# Altium schematic sheet PERIPHERALS.SchDoc: CONNECTOR A
size A2; DrawnBy: UKAYACIK; Engineer: UKAYACIK; DocumentNumber: 12; Revision: B; SheetNumber: 14; SheetTotal: 21
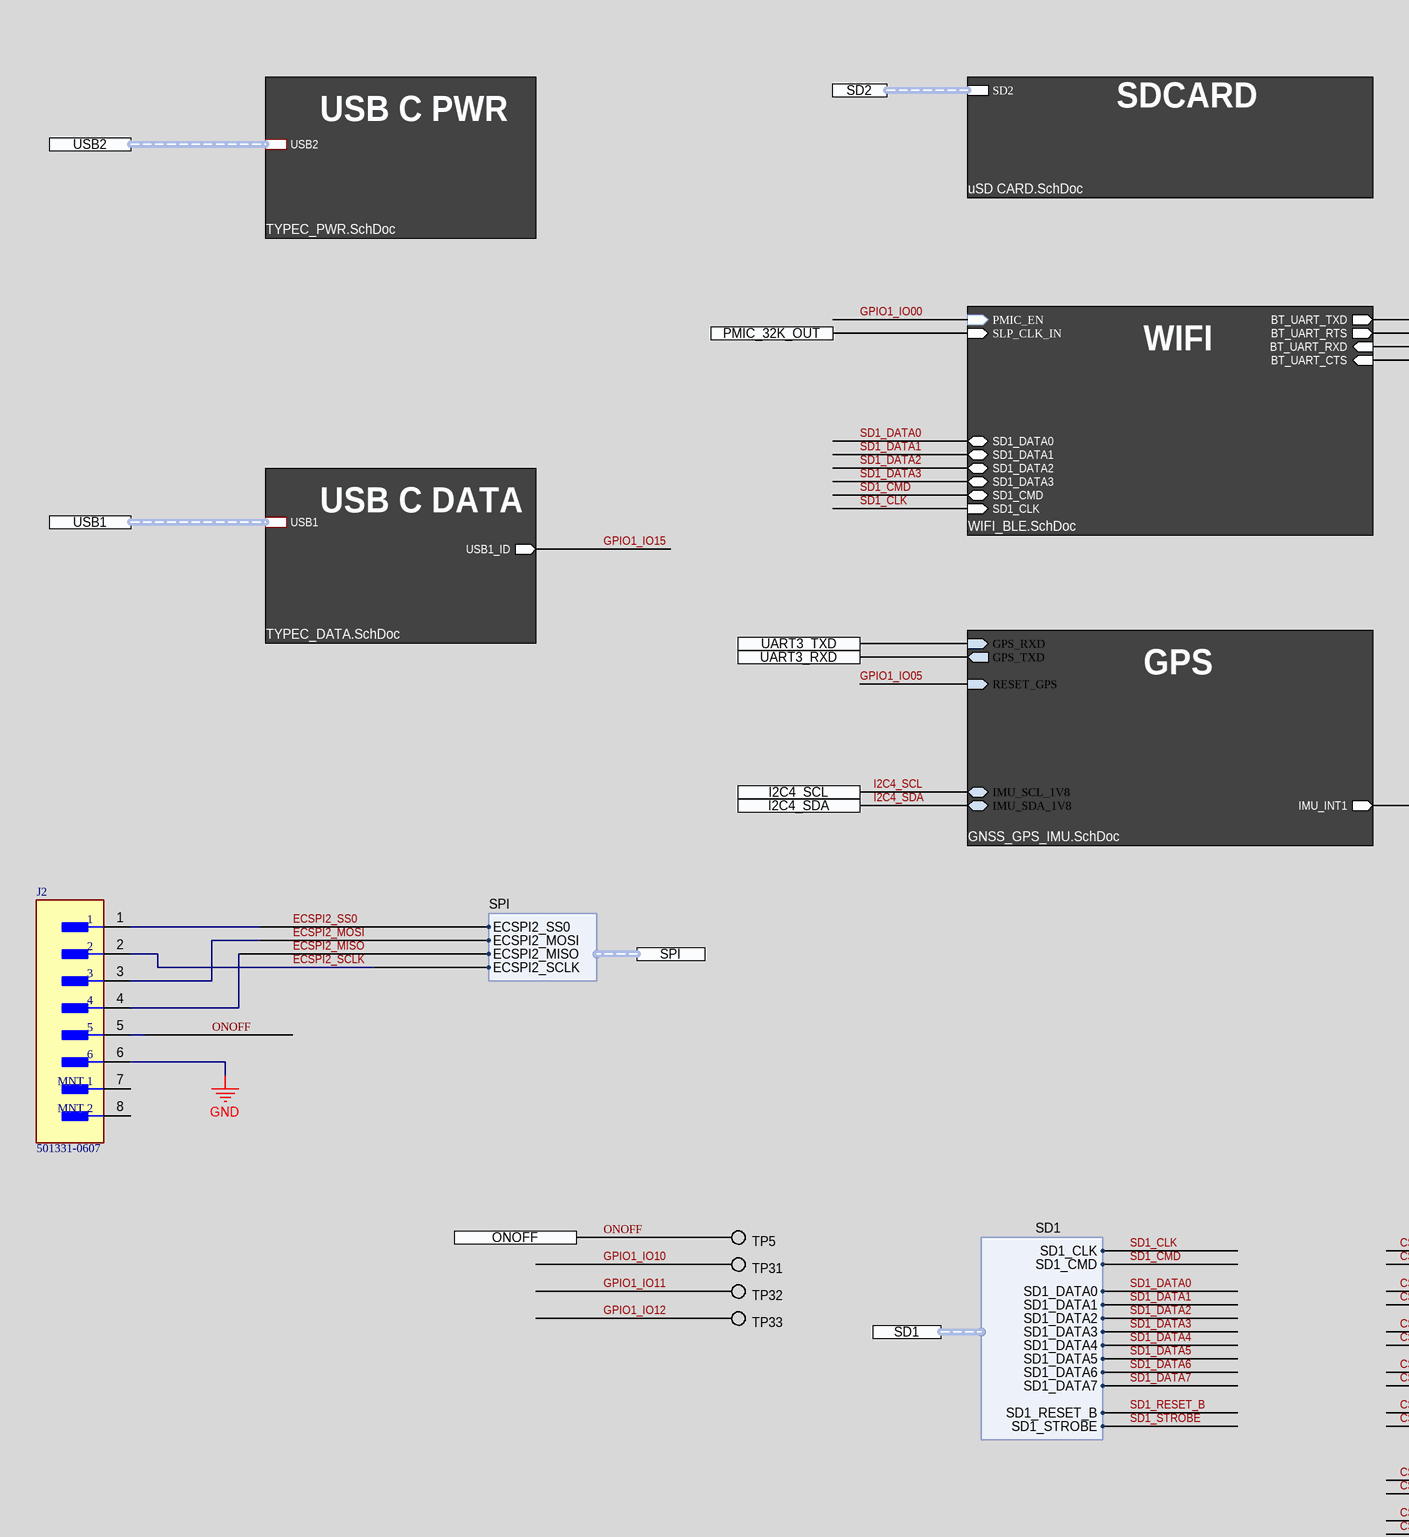
[diagram p0: PERIPHERALS.SchDoc, left]
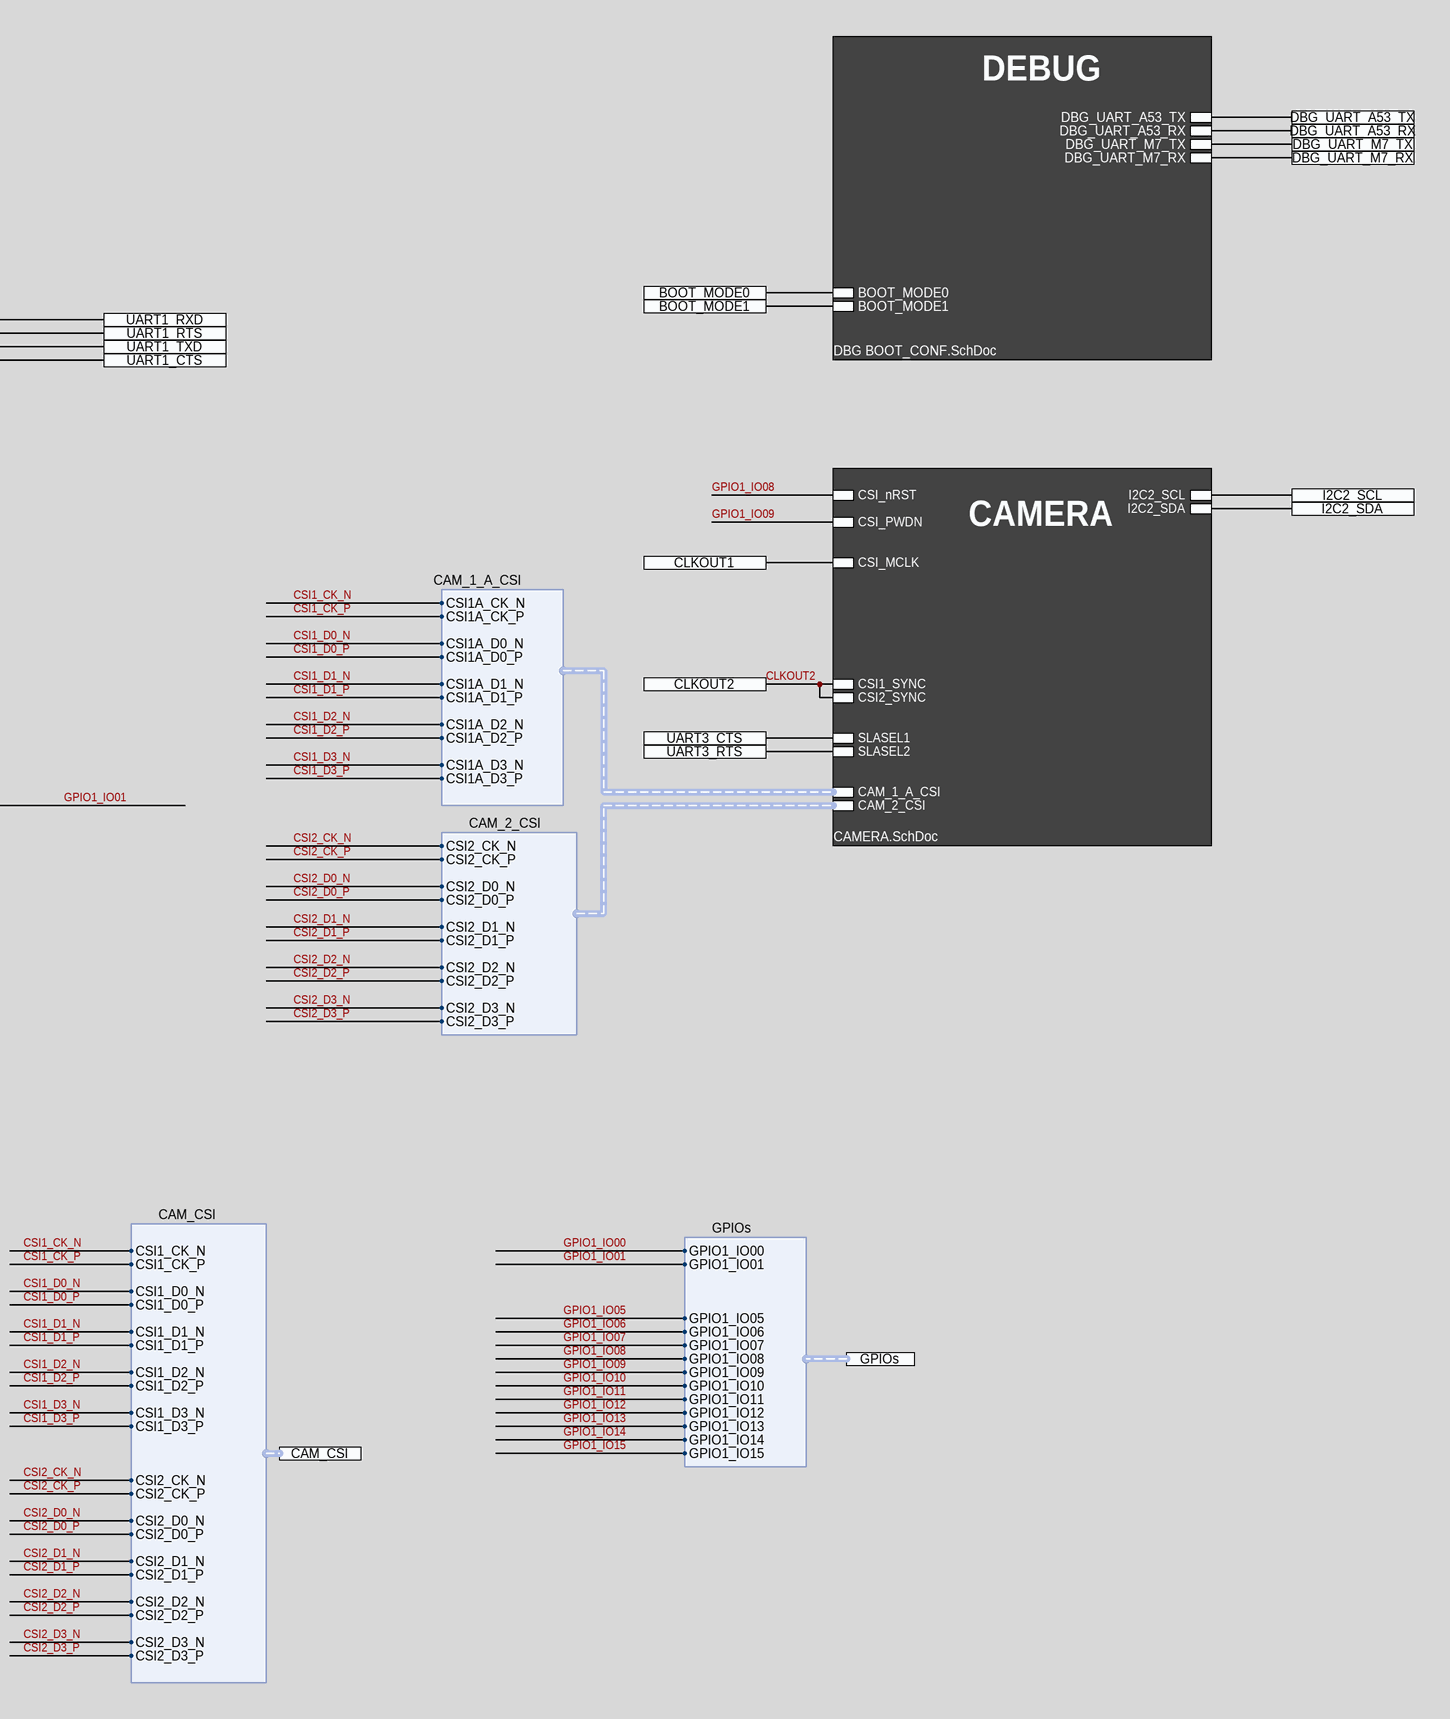
[diagram p1: PERIPHERALS.SchDoc, right]

## Parts
J2  501331-0607  [FP-501331-0607-MFG]
TP5  NO COMPONENT  [TP_PAD_0.5MM_SMD_ROUND]  (value not drawn)  (no BOM)
TP31  NO COMPONENT  [TP_PAD_0.5MM_SMD_ROUND]  (value not drawn)  (no BOM)
TP32  NO COMPONENT  [TP_PAD_0.5MM_SMD_ROUND]  (value not drawn)  (no BOM)
TP33  NO COMPONENT  [TP_PAD_0.5MM_SMD_ROUND]  (value not drawn)  (no BOM)

## Sub-sheets
Designator = TYPEC_PWR.SchDoc: USB2 (harness USB1)
Designator = TYPEC_DATA.SchDoc: USB1 (harness USB1), USB1_ID (out)
U_CAMERA = CAMERA.SchDoc: CSI_PWDN, CSI1_SYNC, CSI_MCLK, CSI_nRST, I2C2_SDA, I2C2_SCL, SLASEL1, CSI2_SYNC, SLASEL2, CAM_2_CSI (harness CAM_2_CSI), CAM_1_A_CSI (harness CAM_1_A_CSI)
U_DBG BOOT_CONF = DBG BOOT_CONF.SchDoc: DBG_UART_A53_TX, DBG_UART_A53_RX, DBG_UART_M7_RX, DBG_UART_M7_TX, BOOT_MODE0, BOOT_MODE1
U_GNSS_GPS_IMU = GNSS_GPS_IMU.SchDoc: IMU_SCL_1V8 (bidir), IMU_SDA_1V8 (bidir), IMU_INT1 (out), GPS_TXD (out), GPS_RXD (in), RESET_GPS (in)
U_uSD CARD = uSD CARD.SchDoc: SD2 (harness SD2)
U_WIFI_BLE = WIFI_BLE.SchDoc: PMIC_EN (in), SLP_CLK_IN (in), SD1_DATA0 (bidir), SD1_DATA1 (bidir), SD1_DATA2 (bidir), SD1_DATA3 (bidir), SD1_CMD (bidir), SD1_CLK (in), BT_UART_CTS (in), BT_UART_RXD (in), BT_UART_TXD (out), BT_UART_RTS (out)

## Ports
BOOT_MODE0, BOOT_MODE1, CAM_CSI (harness CAM_CSI), CLKOUT1, CLKOUT2, DBG_UART_A53_RX, DBG_UART_A53_TX, DBG_UART_M7_RX, DBG_UART_M7_TX, GPIOs (harness GPIOs), I2C2_SCL, I2C2_SDA, I2C4_SCL, I2C4_SDA, ONOFF, PMIC_32K_OUT, SD1 (harness SD1), SD2 (harness SD2), SPI (harness SPI), UART1_CTS, UART1_RTS, UART1_RXD, UART1_TXD, UART3_CTS, UART3_RTS, UART3_RXD, UART3_TXD, USB1 (harness USB1), USB2 (harness USB2)

## Harnesses
SD1: SD1_CMD, SD1_DATA0, SD1_DATA1, SD1_DATA2, SD1_DATA3, SD1_DATA4, SD1_DATA6, SD1_DATA7, SD1_RESET_B, SD1_STROBE, SD1_CLK, SD1_DATA5
CAM_CSI: CSI1_CK_N, CSI1_CK_P, CSI1_D0_N, CSI1_D0_P, CSI1_D1_N, CSI1_D1_P, CSI1_D2_N, CSI1_D2_P, CSI1_D3_N, CSI1_D3_P, CSI2_CK_N, CSI2_CK_P, CSI2_D0_N, CSI2_D0_P, CSI2_D1_N, CSI2_D1_P, CSI2_D2_N, CSI2_D2_P, CSI2_D3_N, CSI2_D3_P
GPIOs: GPIO1_IO00, GPIO1_IO01, GPIO1_IO05, GPIO1_IO06, GPIO1_IO07, GPIO1_IO08, GPIO1_IO09, GPIO1_IO10, GPIO1_IO11, GPIO1_IO12, GPIO1_IO13, GPIO1_IO14, GPIO1_IO15
CAM_2_CSI: CSI2_CK_N, CSI2_CK_P, CSI2_D0_N, CSI2_D0_P, CSI2_D1_N, CSI2_D1_P, CSI2_D2_N, CSI2_D2_P, CSI2_D3_N, CSI2_D3_P
CAM_1_A_CSI: CSI1A_CK_N, CSI1A_CK_P, CSI1A_D0_N, CSI1A_D0_P, CSI1A_D1_N, CSI1A_D1_P, CSI1A_D2_N, CSI1A_D2_P, CSI1A_D3_N, CSI1A_D3_P
SPI: ECSPI2_SS0, ECSPI2_MOSI, ECSPI2_MISO, ECSPI2_SCLK

## Nets
GND: J2.6
BOOT_MODE0: port BOOT_MODE0, sheet U_DBG BOOT_CONF/BOOT_MODE0
BOOT_MODE1: port BOOT_MODE1, sheet U_DBG BOOT_CONF/BOOT_MODE1
CLKOUT1: port CLKOUT1, sheet U_CAMERA/CSI_MCLK
CLKOUT2: port CLKOUT2, sheet U_CAMERA/CSI1_SYNC, sheet U_CAMERA/CSI2_SYNC
CSI1_CK_N: port CAM_CSI.CSI1_CK_N, sheet U_CAMERA/CAM_1_A_CSI.CSI1A_CK_N
CSI1_CK_P: port CAM_CSI.CSI1_CK_P, sheet U_CAMERA/CAM_1_A_CSI.CSI1A_CK_P
CSI1_D0_N: port CAM_CSI.CSI1_D0_N, sheet U_CAMERA/CAM_1_A_CSI.CSI1A_D0_N
CSI1_D0_P: port CAM_CSI.CSI1_D0_P, sheet U_CAMERA/CAM_1_A_CSI.CSI1A_D0_P
CSI1_D1_N: port CAM_CSI.CSI1_D1_N, sheet U_CAMERA/CAM_1_A_CSI.CSI1A_D1_N
CSI1_D1_P: port CAM_CSI.CSI1_D1_P, sheet U_CAMERA/CAM_1_A_CSI.CSI1A_D1_P
CSI1_D2_N: port CAM_CSI.CSI1_D2_N, sheet U_CAMERA/CAM_1_A_CSI.CSI1A_D2_N
CSI1_D2_P: port CAM_CSI.CSI1_D2_P, sheet U_CAMERA/CAM_1_A_CSI.CSI1A_D2_P
CSI1_D3_N: port CAM_CSI.CSI1_D3_N, sheet U_CAMERA/CAM_1_A_CSI.CSI1A_D3_N
CSI1_D3_P: port CAM_CSI.CSI1_D3_P, sheet U_CAMERA/CAM_1_A_CSI.CSI1A_D3_P
CSI2_CK_N: port CAM_CSI.CSI2_CK_N, sheet U_CAMERA/CAM_2_CSI.CSI2_CK_N
CSI2_CK_P: port CAM_CSI.CSI2_CK_P, sheet U_CAMERA/CAM_2_CSI.CSI2_CK_P
CSI2_D0_N: port CAM_CSI.CSI2_D0_N, sheet U_CAMERA/CAM_2_CSI.CSI2_D0_N
CSI2_D0_P: port CAM_CSI.CSI2_D0_P, sheet U_CAMERA/CAM_2_CSI.CSI2_D0_P
CSI2_D1_N: port CAM_CSI.CSI2_D1_N, sheet U_CAMERA/CAM_2_CSI.CSI2_D1_N
CSI2_D1_P: port CAM_CSI.CSI2_D1_P, sheet U_CAMERA/CAM_2_CSI.CSI2_D1_P
CSI2_D2_N: port CAM_CSI.CSI2_D2_N, sheet U_CAMERA/CAM_2_CSI.CSI2_D2_N
CSI2_D2_P: port CAM_CSI.CSI2_D2_P, sheet U_CAMERA/CAM_2_CSI.CSI2_D2_P
CSI2_D3_N: port CAM_CSI.CSI2_D3_N, sheet U_CAMERA/CAM_2_CSI.CSI2_D3_N
CSI2_D3_P: port CAM_CSI.CSI2_D3_P, sheet U_CAMERA/CAM_2_CSI.CSI2_D3_P
DBG_UART_A53_RX: port DBG_UART_A53_RX, sheet U_DBG BOOT_CONF/DBG_UART_A53_RX
DBG_UART_A53_TX: port DBG_UART_A53_TX, sheet U_DBG BOOT_CONF/DBG_UART_A53_TX
DBG_UART_M7_RX: port DBG_UART_M7_RX, sheet U_DBG BOOT_CONF/DBG_UART_M7_RX
DBG_UART_M7_TX: port DBG_UART_M7_TX, sheet U_DBG BOOT_CONF/DBG_UART_M7_TX
ECSPI2_MISO: J2.4 ; port SPI.ECSPI2_MISO
ECSPI2_MOSI: J2.3 ; port SPI.ECSPI2_MOSI
ECSPI2_SCLK: J2.2 ; port SPI.ECSPI2_SCLK
ECSPI2_SS0: J2.1 ; port SPI.ECSPI2_SS0
GPIO1_IO00: sheet U_WIFI_BLE/PMIC_EN, port GPIOs.GPIO1_IO00
GPIO1_IO01: sheet U_GNSS_GPS_IMU/IMU_INT1, port GPIOs.GPIO1_IO01
GPIO1_IO05: sheet U_GNSS_GPS_IMU/RESET_GPS, port GPIOs.GPIO1_IO05
GPIO1_IO06: port GPIOs.GPIO1_IO06
GPIO1_IO07: port GPIOs.GPIO1_IO07
GPIO1_IO08: sheet U_CAMERA/CSI_nRST, port GPIOs.GPIO1_IO08
GPIO1_IO09: sheet U_CAMERA/CSI_PWDN, port GPIOs.GPIO1_IO09
GPIO1_IO10: TP31.1 ; port GPIOs.GPIO1_IO10
GPIO1_IO11: TP32.1 ; port GPIOs.GPIO1_IO11
GPIO1_IO12: TP33.1 ; port GPIOs.GPIO1_IO12
GPIO1_IO13: port GPIOs.GPIO1_IO13
GPIO1_IO14: port GPIOs.GPIO1_IO14
GPIO1_IO15: sheet Designator/USB1_ID, port GPIOs.GPIO1_IO15
I2C2_SCL: port I2C2_SCL, sheet U_CAMERA/I2C2_SCL
I2C2_SDA: port I2C2_SDA, sheet U_CAMERA/I2C2_SDA
I2C4_SCL: port I2C4_SCL, sheet U_GNSS_GPS_IMU/IMU_SCL_1V8
I2C4_SDA: port I2C4_SDA, sheet U_GNSS_GPS_IMU/IMU_SDA_1V8
ONOFF: J2.5 TP5.1 ; port ONOFF
PMIC_32K_OUT: port PMIC_32K_OUT, sheet U_WIFI_BLE/SLP_CLK_IN
SD1_CLK: sheet U_WIFI_BLE/SD1_CLK, port SD1.SD1_CLK
SD1_CMD: sheet U_WIFI_BLE/SD1_CMD, port SD1.SD1_CMD
SD1_DATA0: sheet U_WIFI_BLE/SD1_DATA0, port SD1.SD1_DATA0
SD1_DATA1: sheet U_WIFI_BLE/SD1_DATA1, port SD1.SD1_DATA1
SD1_DATA2: sheet U_WIFI_BLE/SD1_DATA2, port SD1.SD1_DATA2
SD1_DATA3: sheet U_WIFI_BLE/SD1_DATA3, port SD1.SD1_DATA3
SD1_DATA4: port SD1.SD1_DATA4
SD1_DATA5: port SD1.SD1_DATA5
SD1_DATA6: port SD1.SD1_DATA6
SD1_DATA7: port SD1.SD1_DATA7
SD1_RESET_B: port SD1.SD1_RESET_B
SD1_STROBE: port SD1.SD1_STROBE
UART1_CTS: port UART1_CTS, sheet U_WIFI_BLE/BT_UART_CTS
UART1_RTS: port UART1_RTS, sheet U_WIFI_BLE/BT_UART_RTS
UART1_RXD: port UART1_RXD, sheet U_WIFI_BLE/BT_UART_TXD
UART1_TXD: port UART1_TXD, sheet U_WIFI_BLE/BT_UART_RXD
UART3_CTS: port UART3_CTS, sheet U_CAMERA/SLASEL1
UART3_RTS: port UART3_RTS, sheet U_CAMERA/SLASEL2
UART3_RXD: port UART3_RXD, sheet U_GNSS_GPS_IMU/GPS_TXD
UART3_TXD: port UART3_TXD, sheet U_GNSS_GPS_IMU/GPS_RXD

Not connected (* = marked no-connect by the designer): J2 7(MNT_1) 8(MNT_2)

## Buses and harness runs
harness port SD2 = sheet U_uSD CARD/SD2
harness port USB1 = sheet Designator/USB1
harness port USB2 = sheet Designator/USB2

## Notes on the sheet
- DEBUG
- USB C PWR
- SDCARD
- WIFI
- USB C DATA
- CAMERA
- GPS
- PCB Des :
- Approv By :
- Project Title :
- Sheet Title :
- Date :
- Page :
- PCB Version :
- PCB Revision :
- Size :
- A2

## Library data of the parts
J2 = CMP-04776-000269-1: CONN HEADER SMD 6POS 1MM; Number of Positions: 6; Glow Wire Compliant: Non-compliant; Current Rating: 1A; Voltage Rating (AC): 50V; Gender: Male; Contact Resistance: 20mR; Connector Type: Male Pin; Max Voltage Rating (DC): 5.05kV; Color: Natural; Radiation Hardening: No; Housing Color: Natural; Max Operating Temperature: 85°C; Fastening Type: Detent; Min Operating Temperature: -40°C; Series: 501331; Orientation: Vertical; Number of Contacts: 6; Number of Circuits: 6; Contact Material: Bronze; Contact Gender: Male; Contact Plating: Tin; Lead Free: Lead Free; Number of Rows: 1; Max Voltage Rating (AC): 50V; Depth: 5.07mm; Pitch: 1mm; Packaging: Tape and Reel; Termination: Solder; RoHS Compliant: Yes; Mount: Surface Mount; Housing Material: Nylon; Voltage Rating: 50V; Contact Type: Male Pin; Package Quantity: 1100
TP5 TP31-TP33 = TP_PAD_SMD_SMALL: Test Point, SMD pad, round, 1.5mm, 1.6mm, 3mm diameter